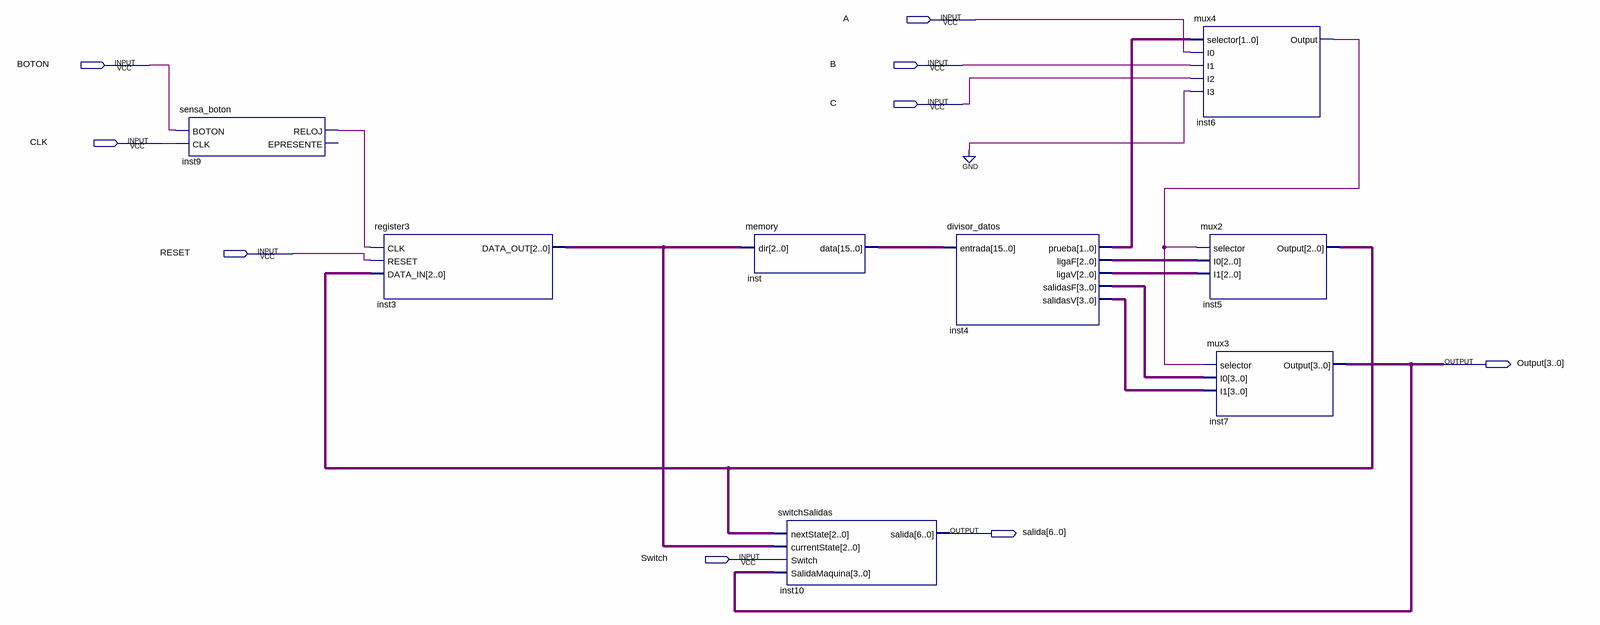
[diagram p0: schematic sheet]
// Quartus schematic LOAC_P4.bdf as structural Verilog: 8 symbols, 9 pins
module LOAC_P4 (
  input  A,
  input  BOTON,
  input  B,
  input  C,
  input  CLK,
  input  RESET,
  input  Switch,
  output [3:0] Output,
  output [6:0] salida
);

  wire inst6_output, inst9_reloj;
  wire [1:0] inst4_prueba;
  wire [2:0] inst3_data_out, inst4_ligaf, inst4_ligav, inst5_output;
  wire [3:0] inst4_salidasf, inst4_salidasv;
  wire [15:0] inst_data;

  sensa_boton inst9 (.BOTON(BOTON), .CLK(CLK), .RELOJ(inst9_reloj));  // open: EPRESENTE
  register3 inst3 (.CLK(inst9_reloj), .RESET(RESET), .DATA_IN(inst5_output), .DATA_OUT(inst3_data_out));
  memory inst (.dir(inst3_data_out), .data(inst_data));
  switchSalidas inst10 (
    .nextState(inst5_output), .currentState(inst3_data_out), .Switch(Switch), .SalidaMaquina(Output),
    .salida(salida));
  divisor_datos inst4 (
    .entrada(inst_data), .prueba(inst4_prueba), .ligaF(inst4_ligaf), .ligaV(inst4_ligav),
    .salidasF(inst4_salidasf), .salidasV(inst4_salidasv));
  mux4 inst6 (.selector(inst4_prueba), .I0(A), .I1(B), .I2(C), .I3(1'b0), .Output(inst6_output));
  mux2 inst5 (.selector(inst6_output), .I0(inst4_ligaf), .I1(inst4_ligav), .Output(inst5_output));
  mux3 inst7 (.selector(inst6_output), .I0(inst4_salidasf), .I1(inst4_salidasv), .Output(Output));
endmodule
